# EAGLE design pmc3 (EAGLE 7.7.0)
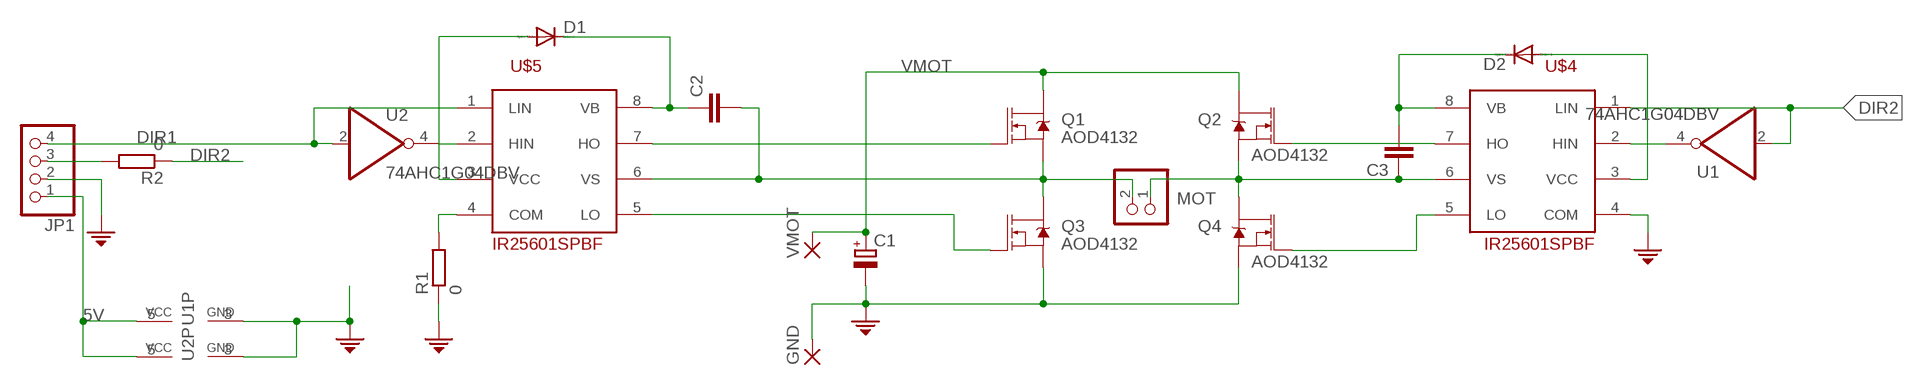
[diagram p0: schematic, sheet 1]

## Parts
C1  CPOL-EUE5-13  [E5-13]
C2  C-EUC0805  [C0805]
C3  C-EUC0805  [C0805]
D1  DIODE-SOD123  [SOD123]
D2  DIODE-SOD123  [SOD123]
GND  SMD5  [SMD2,54-5,08]
JP1  PINHD-1X4/90  [1X04/90]
MOT  PINHD-1X2  [1X02]
Q1  AOD4132  MOSFET-NCH-FDD8780  [DPAK]
Q2  AOD4132  MOSFET-NCH-FDD8780  [DPAK]
Q3  AOD4132  MOSFET-NCH-FDD8780  [DPAK]
Q4  AOD4132  MOSFET-NCH-FDD8780  [DPAK]
R1  0  R-EU_R1206  [R1206]
R2  0  R-EU_R1206  [R1206]
U1  74AHC1G04DBV  [SOT23-5]
U2  74AHC1G04DBV  [SOT23-5]
U$4  IR25601SPBF  [SO08]
U$5  IR25601SPBF  [SO08]
VMOT  SMD5  [SMD2,54-5,08]

## Nets
5V: D1.A D2.A JP1.1 U1.5(VCC) U2.5(VCC) U$4.3(VCC) U$5.3(VCC)
D1O: C2.2 MOT.2 Q1.3(S) Q3.4(D) U$5.6(VS)
D2O: C3.1 MOT.1 Q2.3(S) Q4.4(D) U$4.6(VS)
DIR1: JP1.4 U2.2(I) U$5.1(LIN)
DIR2: R2.1 U1.2(I) U$4.1(LIN)
GND: C1.- GND.1(P) JP1.2 Q3.3(S) Q4.3(S) R1.1 U1.3(GND) U2.3(GND) U$4.4(COM)
N$1: R1.2 U$5.4(COM)
N$2: JP1.3 R2.2
N$7: Q3.1(G) U$5.5(LO)
N$8: Q1.1(G) U$5.7(HO)
N$10: U2.4(O) U$5.2(HIN)
N$12: U1.4(O) U$4.2(HIN)
N$14: Q4.1(G) U$4.5(LO)
N$16: Q2.1(G) U$4.7(HO)
VBOOT1: C2.1 D1.C U$5.8(VB)
VBOOT2: C3.2 D2.C U$4.8(VB)
VMOT: C1.+ Q1.4(D) Q2.4(D) VMOT.1(P)

## Library data of the parts
C1 = rcl:CPOL-EU: POLARIZED CAPACITOR, European symbol
C2 C3 = rcl:C-EU: CAPACITOR, European symbol
D1 D2 = diode:DIODE-: DIODE
GND VMOT = wirepad:SMD5: SMD PAD
JP1 = pinhead:PINHD-1X4: PIN HEADER
MOT = pinhead:PINHD-1X2: PIN HEADER
Q1-Q4 = SparkFun-DiscreteSemi:MOSFET-NCH: N-channel MOSFETs Voltage controlled devices that allow control of high current outputs. SparkFun Products: SparkFun OpenScale <https://www.sparkfun.com/products/13261> SparkFun Digital Sandbox <https://www.sparkfun.com/products/12651> SparkFun Monster Moto Shield <https://www.sparkfun.com/products/10182> SparkFun MOSFET Power Controller <https://www.sparkfun.com/products/11214>; PROD_ID: TRANS-09984; VALUE: 35A/25V/8.5mΩ
R1 R2 = rcl:R-EU_: RESISTOR, European symbol
U1 U2 = 74xx-little-de:74*1G04: INVERTER Gate
U$4 U$5 = custom:IR25601SPBF: Half-Bridge MOSFET driver

## Board
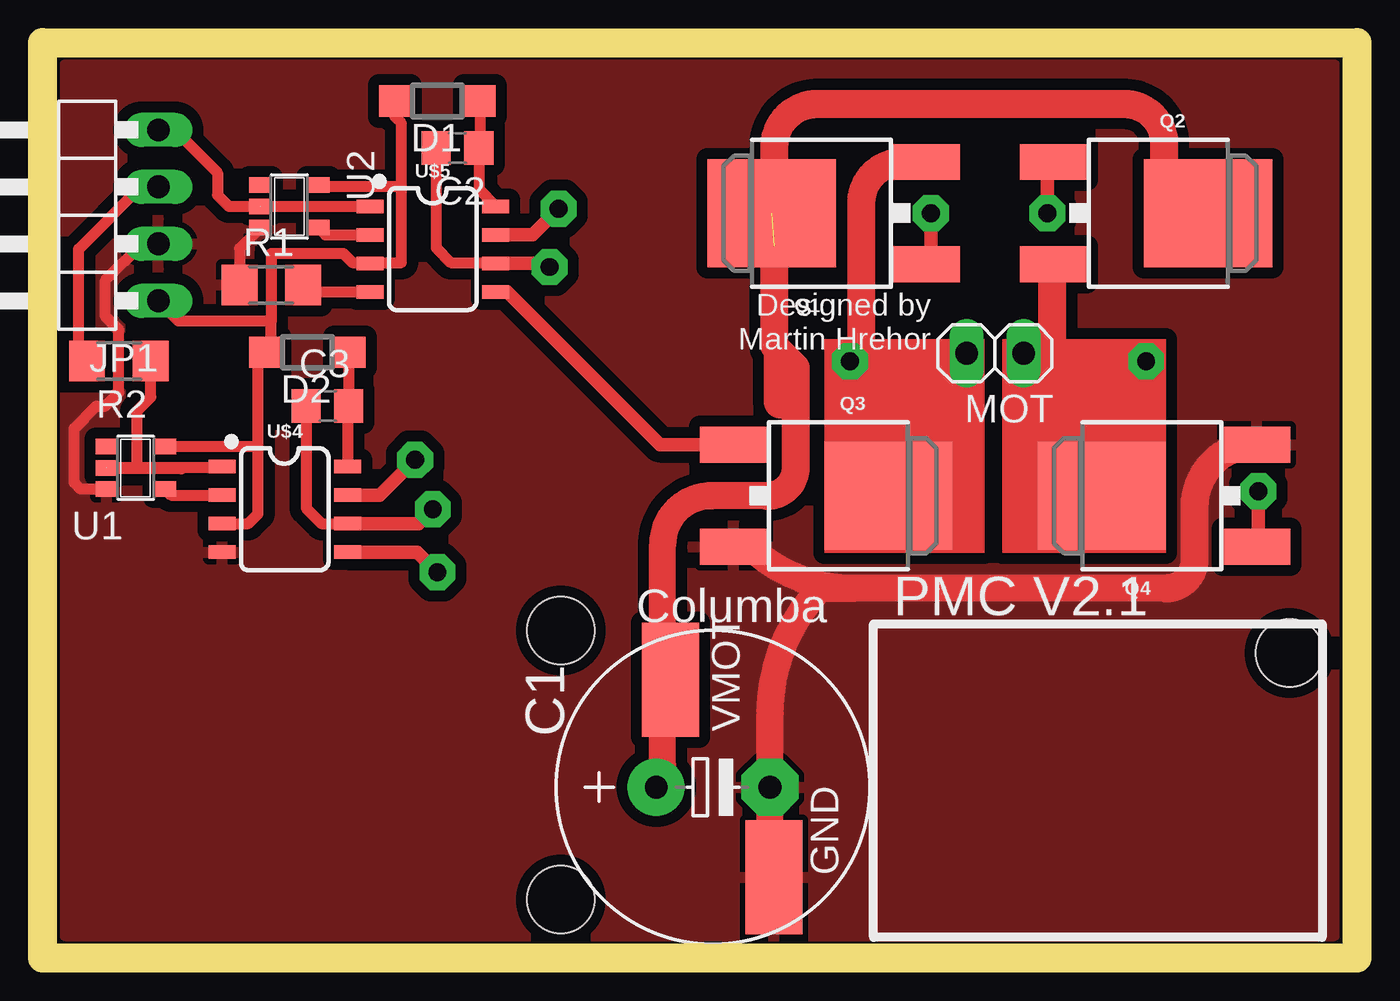
[diagram p1: board, top side]
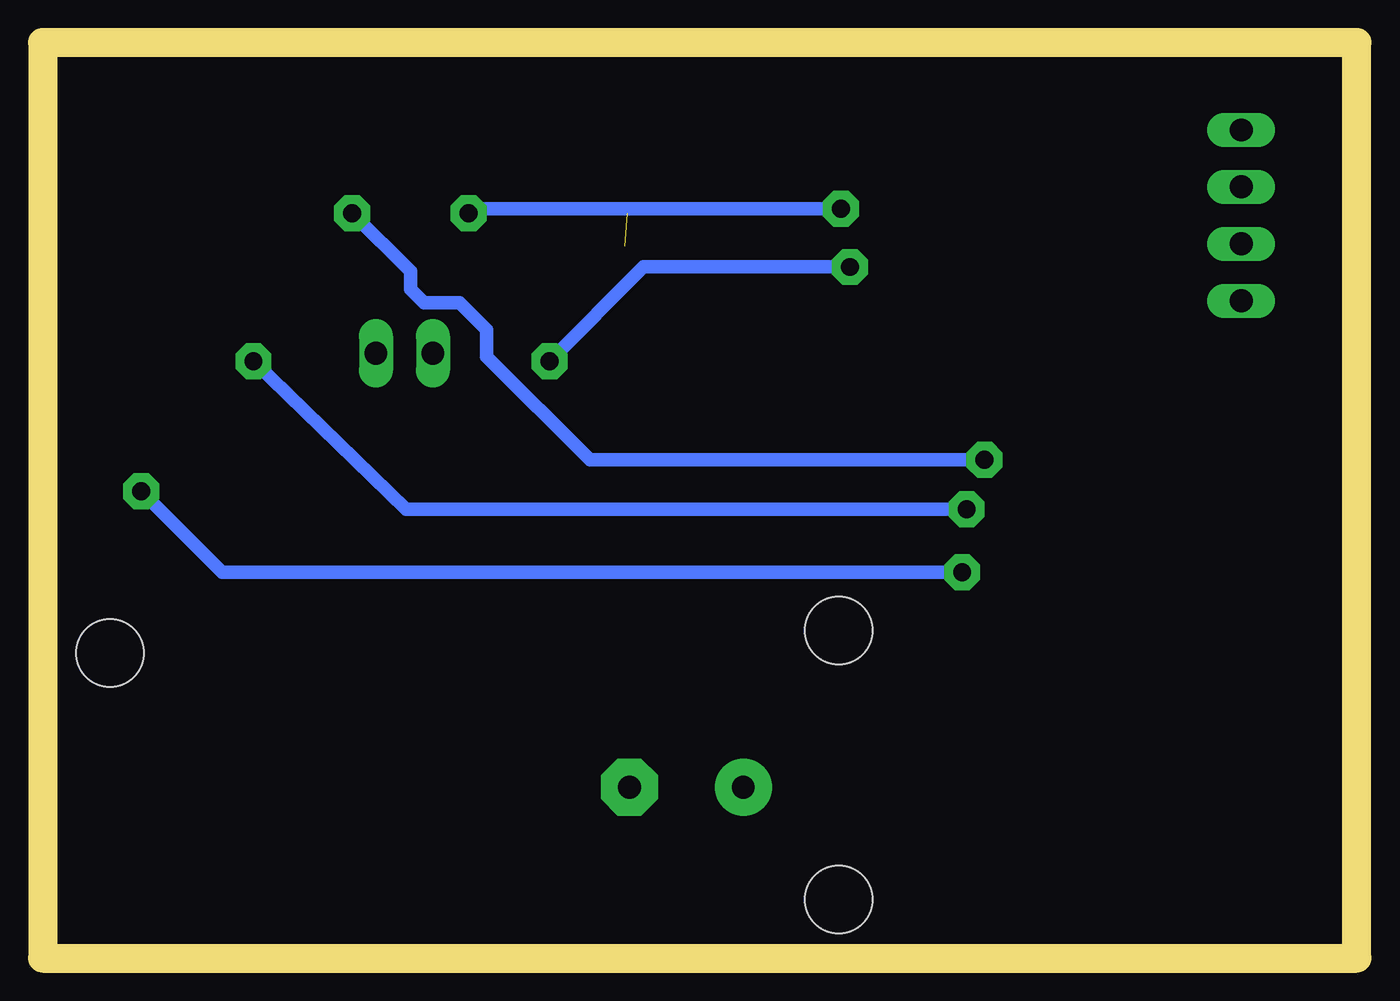
[diagram p2: board, bottom side, seen from below]

Size 57.4 x 39.6 mm. Coordinates in mm from the lower left corner, seen from the top.
Outline: 0,0 57.4,0 57.4,39.6 0,39.6 0,0
Copper layers (1*16): Top 0.035mm / dielectric 1.5mm / Bottom 0.035mm
Design rules "jlcpcb *": minimum track width 5mil, minimum drill 0.3mm, track to track 5mil, track to pad 5mil, pad to pad 5mil, via to via 5mil, smd to smd 5mil, copper to edge 0mil, drill to drill 5mil, minimum pad ring 10mil, minimum via ring 8mil, stop-mask expansion 4mil, vias tented up to drill 0mil, thermal gap 10mil
Holes 3 mm at 22.5,2 22.5,14 55,13
Milling: 4 lines

### Footprints (pad centres in the part's own frame; a part is rotated, then mirrored left to right if it is on the bottom)
E5-13 = drill 1.016 pad 2.54: + -2.54,0 | drill 1.016 pad 2.54 octagon: - 2.54,0
C0805 = smd 1.3 x 1.5: 1 -0.95,0; 2 0.95,0
SOD123 = smd 1.4 x 1.4: A 1.9,0; C -1.9,0
SMD2,54-5,08 = smd 2.54 x 5.08: 1 0,0
1X04/90 = drill 1.016 long: 1 -3.81,-3.81; 2 -1.27,-3.81; 3 1.27,-3.81; 4 3.81,-3.81
1X02 = drill 1.016 long: 1 -1.27,0; 2 1.27,0
DPAK = smd 1.6 x 3: 1 -2.28,-5.31; 3 2.28,-5.31 | smd 4.826 x 5.715: 4 0,1.588
R1206 = smd 1.6 x 1.803: 1 -1.422,0; 2 1.422,0
SOT23-5 = smd 0.69 x 0.99: 1 -0.95,-1.29; 2 0,-1.29; 3 0.95,-1.29; 4 0.95,1.3; 5 -0.95,1.3
SO08 = smd 0.6 x 1.2: 1 -1.905,-2.8; 2 -0.635,-2.8; 3 0.635,-2.8; 4 1.905,-2.8; 5 1.905,2.8; 6 0.635,2.8; 7 -0.635,2.8; 8 -1.905,2.8

### Placement (x,y rotation side)
C1  29.3,7.01 0 top
C2  17.9,35.5 180 top
C3  12.1,24 0 top
D1  17,37.6 180 top
D2  11.2,26.4 180 top
GND  32,3 0 top
JP1  0.75,32.5 90 top
MOT  41.87,26.35 180 top
Q1  33.5,32.6 90 top
Q2  49.78,32.6 270 top
Q3  35.52,20 270 top
Q4  48.22,20 90 top
R1  9.6,29.4 0 top
R2  2.8,26 180 top
U1  3.55,21.25 270 top
U2  10.4,32.9 270 top
U$4  10.2,19.4 270 top
U$5  16.8,31 270 top
VMOT  27.4,11.8 0 top

### Tracks (layer width: path | path; a pad name or v marks a point on that pad's centre or on a via)
5V
  Top 0.5: U$4.3 8.56,18.77 9,19.2 9,22.2 | 9,22.2 9,26.1 D2.A 9.6,26.7 9.6,27.8 | 15.4,33.8 15.4,30.4 14.04,30.4 | 15.4,33.8 15.4,36.6 15.1,36.9 D1.A | U$5.3 14.04,30.4 | U2.5 11.75,33.8 15.4,33.8 | U1.5 9,22.2 | 14.04,30.4 13.22,30.4 12.82,30.8 9.6,30.8 9.6,27.8 | JP1.1 5.45,27.8 9.6,27.8
D1O  (via drill 0.8)
  Top 0.5: C2.2 16.95,31.05 17.6,30.4 19.57,30.4 U$5.6
  Top 0.6: U$5.6 21.84,30.36 v22,30.2 | v35.4,26 35.85,26 35.95,26.11
  Top 1.25: Q3.4 35.95,26.11 35.91,26.35 | 35.91,26.35 35.91,33.05 arc-90 37.73,34.88 Q1.3 | MOT.2 35.91,26.35
  Bottom 0.6: v22,30.2 31.2,30.2 v35.4,26
D2O  (via drill 0.8)
  Top 0.5: C3.1 11.15,19.45 11.84,18.77 U$4.6
  Top 0.6: U$4.6 16.16,18.77 v16.8,19.4 | v48.6,26 44.88,26.2 44.48,25.81
  Top 1.25: Q4.4 44.48,25.81 44.43,25.95 | 44.43,25.95 44.43,30.28 | 44.43,30.28 44.43,30.38 | MOT.1 44.43,25.95 | Q2.3 arc90 44.43,30.28
  Bottom 0.6: v16.8,19.4 41.8,19.4 v48.6,26
DIR1
  Top 0.5: U$5.1 U2.2 7.7,32.9 7.2,33.4 7.2,34.4 5.29,36.31 JP1.4
DIR2
  Top 0.5: U$4.1 7.34,21.25 3.6,21.25 | 3.6,21.25 U1.2 2.21,21.2 5.6,21.2 | 3.6,21.25 3.6,23.78 4.22,24.4 R2.1
GND
  Top 0.5: Q4.3 | U2.3 8.18,31.02 R1.1 | U1.3 1.1,20.3 0.8,20.6 0.8,23 1.8,24 2.2,24 2.8,24.6 2.8,27.4 2.2,28 2.2,29.6 3.83,31.23 JP1.2
  Top 1.2: 49.49,15.88 35.57,15.88 | 35.57,15.88 arc-45 30.8,17.85 30.52,17.85 arc45 Q3.3 | 35.57,15.88 34.5,15.88 arc-45 34.2,16 arc45 31.84,10.3 C1.- 31.84,3.39 arc45 GND.1
  Top 1.25: Q4.3 arc90 50.76,19.51 50.76,17.14 arc-90 49.49,15.88
  pour Top (isolate 0.5): 0.4,39.2 0.4,0.4 57,0.4 57,39.2
N$1
  Top 0.5: R1.2 11.33,29.09 U$5.4
N$2
  Top 0.5: R2.2 1,25.98 1,31 3.77,33.77 JP1.3
N$7
  Top 0.6: U$5.5 20.11,29.09 26.92,22.28 Q3.1
N$8  (via drill 0.8)
  Top 0.6: U$5.7 21.23,31.64 v22.4,32.8 | v39,32.6 39,30.51 Q1.1
  Bottom 0.6: v22.4,32.8 38.8,32.8 v39,32.6
N$10
  Top 0.5: U2.4 12.02,31.64 U$5.2
N$12
  Top 0.5: U1.4 5.12,20.04 U$4.2
N$14  (via drill 0.8)
  Top 0.6: U$4.5 16.11,17.5 v17,16.6 | v53.6,20.2 53.6,17.79 Q4.1
  Bottom 0.6: v17,16.6 50,16.6 v53.6,20.2
N$16  (via drill 0.8)
  Top 0.6: U$4.7 14.44,20.04 v16,21.6 | v44.2,32.6 44.2,34.61 Q2.1
  Bottom 0.6: v16,21.6 33.6,21.6 38.2,26.2 38.2,27.4 39.4,28.6 41,28.6 41.6,29.2 41.6,30 v44.2,32.6
VBOOT1
  Top 0.5: D1.C 18.9,35.55 C2.1 18.85,33.66 U$5.8
VBOOT2
  Top 0.5: U$4.8 13,23.95 C3.2 13.05,26.35 D2.C
VMOT  (1 unrouted)
  Top 0.6: VMOT.1 27.05,11.8
  Top 1: 32.03,26.67 arc-45 32.3,26.01 32.3,25.2
  Top 1.2: 31.71,20 29.2,20 arc90 27.05,17.85 27.05,11.8 27.05,7.97 arc-45 26.76,7.27 C1.+
  Top 1.25: 31.71,20 arc90 32.98,21.27 32.98,25.72 32.03,26.67 32.03,31.11 | 32.03,31.11 32.03,35.56 arc-90 33.93,37.47 47.64,37.47 arc-90 49.4,35.71 49.4,32.6 Q2.4 | 31.97,31.06 arc90 32.03,31.11
  Top 1.5: 32.3,26.2 32.3,25.2 32.3,24.2
(copper drawn outside any net)
  shapes: Top area x4

### Text on the board
tNames: Designed by / Martin Hrehor | Columba | PMC V2.1